# Altium schematic sheet Connectors.SchDoc: IO Connector
size A4; DocumentNumber: 2; SheetNumber: 2; SheetTotal: 10
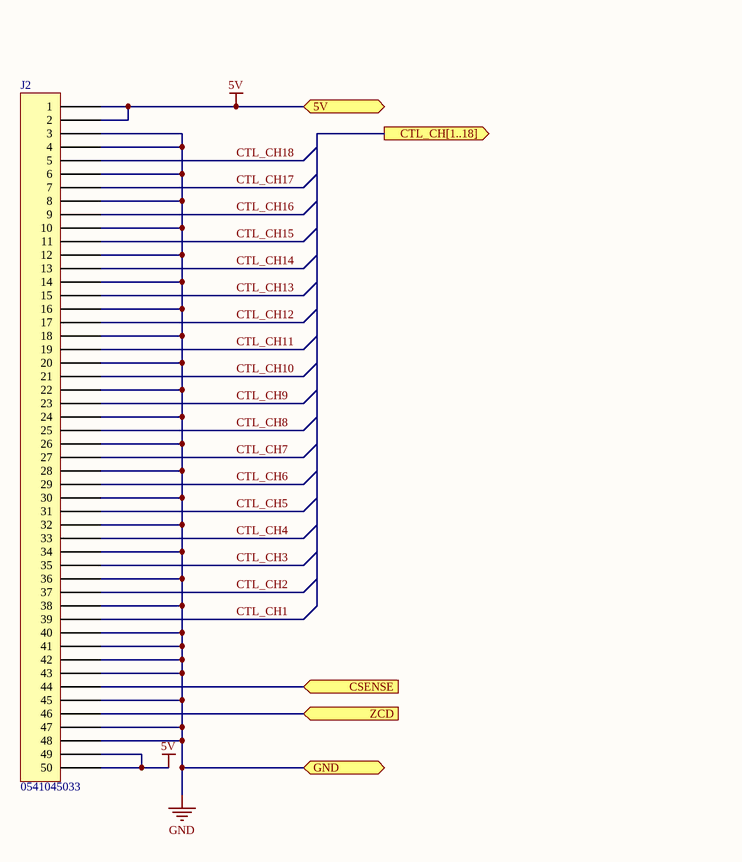
[diagram p0: Connectors.SchDoc]

## Parts
J2  0541045033  [MOLEX 0541045033]

## Ports
5V (bidir, see Review[2B], AC DC Powersupply[3B], AC Detection[1A], Opto[1B], SSR Control[1A], Supply 5V[2B], Supply 15V[2B]), CSENSE (in, see Review[2B], AC Detection[1B]), CTL_CH[1..18] (out, see Review[2B], SSR Control[1A]), GND (bidir, see Review[2B], AC DC Powersupply[3B], AC Detection[1A], Supply 5V[2C], Supply 15V[2C]), ZCD (in, see Review[2B], AC Detection[4D])

## Nets
5V: J2.1 J2.2 J2.49 J2.50 ; port 5V
GND: J2.3 J2.4 J2.6 J2.8 J2.10 J2.12 J2.14 J2.16 J2.18 J2.20 J2.22 J2.24 J2.26 J2.28 J2.30 J2.32 J2.34 J2.36 J2.38 J2.40 J2.41 J2.42 J2.43 J2.45 J2.47 J2.48 ; port GND
CSENSE: J2.44 ; port CSENSE
CTL_CH1: J2.39
CTL_CH2: J2.37
CTL_CH3: J2.35
CTL_CH4: J2.33
CTL_CH5: J2.31
CTL_CH6: J2.29
CTL_CH7: J2.27
CTL_CH8: J2.25
CTL_CH9: J2.23
CTL_CH10: J2.21
CTL_CH11: J2.19
CTL_CH12: J2.17
CTL_CH13: J2.15
CTL_CH14: J2.13
CTL_CH15: J2.11
CTL_CH16: J2.9
CTL_CH17: J2.7
CTL_CH18: J2.5
ZCD: J2.46 ; port ZCD

## Notes on the sheet
- Title
- Size:
- Date:
- A4
- Number:
- Time:
- Revision:
- Sheet
- of
- File:

## Library data of the parts
J2 = 0541045033: CONN FFC TOP 50POS 0.50MM R/A; Manufacturer: Molex; Actuator Material: Polyphenylene Sulfide (PPS), Glass Filled; Cable End Type: Straight, Tapered; Connector/Contact Type: Contacts, Top; FFC, FCB Thickness: 0.30mm; Flat Flex Type: FFC, FPC; Locking Feature: Slide Lock; Material Flammability Rating: UL94 V-0; Number of Positions: 50; Pitch: 0.020" (0.50mm); Part Number: 0541045033; ComponentLink1Description: Datasheet; ComponentLink1URL: https://www.molex.com/pdm_docs/sd/541044633_sd.pdf; ComponentLink2Description: DigiKey Link; ComponentLink2URL: https://www.digikey.com/en/products/detail/molex/0541045033/4444679; Contact Finish: Tin Bismuth; Contact Material: Phosphor Bronze; Features: Solder Retention, Zero Insertion Force (ZIF); Height Above Board: 0.079" (2.00mm); Housing Material: Polyamide (PA), Nylon, Glass Filled; LastUpdated: 6/14/2023 5:52:56 PM; Lifecycle Status: Active; Minimum Order: 1; Mounting Type: Surface Mount, Right Angle; Operating Temperature: -40°C ~ 85°C; Packaging: TapeAndReel; Part Status: Active; Price: 1.69; Series: Easy-On 54104; Supplier 1: DigiKey; Supplier Part Number 1: WM11093CT-ND; Termination: Solder